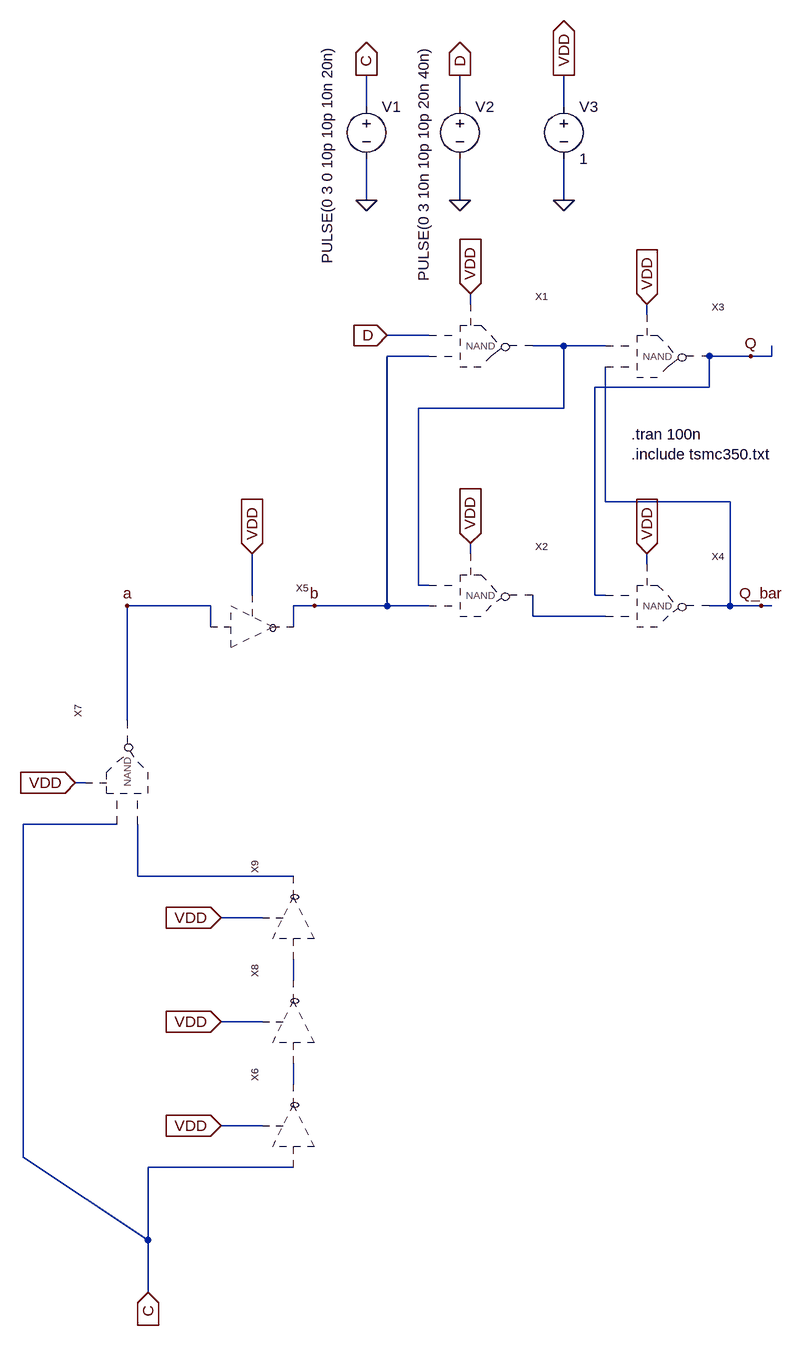
[diagram p0: schematic lab9t1.asc]
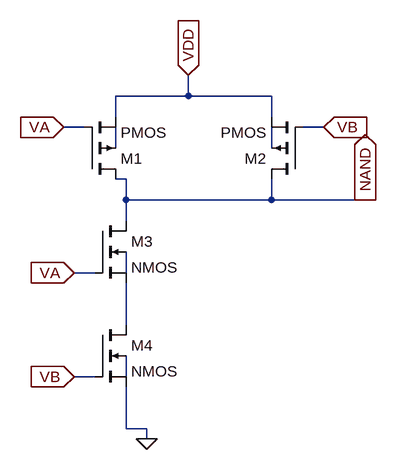
[diagram p1: sub-circuit nand.asc]
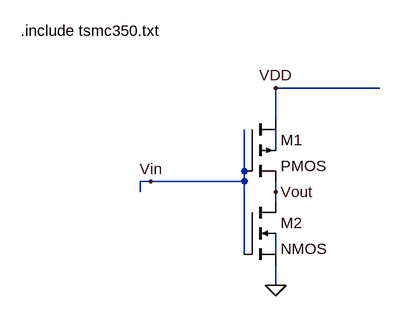
[diagram p2: sub-circuit symb.asc]
lab9t1.asc, the LTspice schematic file:
Version 4
SHEET 1 1080 1788
WIRE 416 -96 416 -144
WIRE 560 -96 560 -144
WIRE 720 -96 720 -144
WIRE 416 48 416 -16
WIRE 560 48 560 -16
WIRE 720 48 720 -16
WIRE 576 208 576 192
WIRE 848 224 848 208
WIRE 512 256 448 256
WIRE 720 272 672 272
WIRE 784 272 720 272
WIRE 512 288 448 288
WIRE 1008 288 944 288
WIRE 1040 288 1040 272
WIRE 1040 288 1008 288
WIRE 944 336 944 288
WIRE 944 336 768 336
WIRE 720 368 720 272
WIRE 720 368 496 368
WIRE 784 512 784 304
WIRE 976 512 784 512
WIRE 576 592 576 576
WIRE 848 608 848 592
WIRE 496 640 496 368
WIRE 512 640 496 640
WIRE 240 656 240 592
WIRE 768 656 768 336
WIRE 784 656 768 656
WIRE 176 672 48 672
WIRE 336 672 304 672
WIRE 448 672 448 288
WIRE 448 672 336 672
WIRE 512 672 448 672
WIRE 976 672 976 512
WIRE 976 672 944 672
WIRE 1024 672 976 672
WIRE 1040 672 1024 672
WIRE 672 688 672 656
WIRE 784 688 672 688
WIRE 176 704 176 672
WIRE 304 704 304 672
WIRE 48 848 48 672
WIRE -16 944 -32 944
WIRE 32 1008 -112 1008
WIRE 64 1088 64 1008
WIRE 304 1088 64 1088
WIRE 256 1152 192 1152
WIRE 304 1248 304 1216
WIRE 256 1312 192 1312
WIRE 304 1408 304 1376
WIRE 256 1472 192 1472
WIRE -112 1520 -112 1008
WIRE 304 1536 80 1536
WIRE 80 1648 -112 1520
WIRE 80 1648 80 1536
WIRE 80 1728 80 1648
FLAG 576 192 VDD
IOPIN 576 192 In
FLAG 848 208 VDD
IOPIN 848 208 In
FLAG 576 576 VDD
IOPIN 576 576 In
FLAG 848 592 VDD
IOPIN 848 592 In
FLAG 1008 288 Q
FLAG 1024 672 Q_bar
FLAG 448 256 D
IOPIN 448 256 In
FLAG 416 48 0
FLAG 560 48 0
FLAG 720 48 0
FLAG 416 -144 C
IOPIN 416 -144 Out
FLAG 560 -144 D
IOPIN 560 -144 Out
FLAG 720 -144 VDD
IOPIN 720 -144 Out
FLAG 192 1472 VDD
IOPIN 192 1472 In
FLAG -32 944 VDD
IOPIN -32 944 In
FLAG 240 592 VDD
IOPIN 240 592 In
FLAG 80 1728 C
IOPIN 80 1728 In
FLAG 336 672 b
FLAG 48 672 a
FLAG 192 1312 VDD
IOPIN 192 1312 In
FLAG 192 1152 VDD
IOPIN 192 1152 In
SYMBOL NAND 608 272 R0
SYMATTR InstName X1
SYMBOL NAND 608 656 R0
SYMATTR InstName X2
SYMBOL NAND 880 288 R0
SYMATTR InstName X3
SYMBOL NAND 880 672 R0
SYMATTR InstName X4
SYMBOL Voltage 416 -112 R0
WINDOW 3 -60 -79 VRight 2
SYMATTR Value PULSE(0 3 0 10p 10p 10n 20n)
SYMATTR InstName V1
SYMBOL Voltage 560 -112 R0
WINDOW 3 -56 -79 VRight 2
SYMATTR Value PULSE(0 3 10n 10p 10p 20n 40n)
SYMATTR InstName V2
SYMBOL Voltage 720 -112 R0
SYMATTR InstName V3
SYMATTR Value 1
SYMBOL NAND 48 912 R270
SYMATTR InstName X7
SYMBOL symb 240 704 R0
SYMATTR InstName X5
SYMBOL symb 304 1472 R270
SYMATTR InstName X6
SYMBOL symb 304 1312 R270
SYMATTR InstName X8
SYMBOL symb 304 1152 R270
SYMATTR InstName X9
TEXT 824 408 Left 2 !.tran 100n\n.include tsmc350.txt

nand.asc, the sub-circuit schematic file:
Version 4
SHEET 1 880 680
WIRE 416 112 416 80
WIRE 416 112 304 112
WIRE 544 112 416 112
WIRE 304 144 304 112
WIRE 544 144 544 112
WIRE 256 160 224 160
WIRE 624 160 592 160
WIRE 304 192 304 160
WIRE 544 192 544 160
WIRE 320 240 304 240
WIRE 320 272 320 240
WIRE 544 272 544 240
WIRE 544 272 320 272
WIRE 688 272 544 272
WIRE 704 272 688 272
WIRE 320 304 320 272
WIRE 272 384 240 384
WIRE 320 384 320 352
WIRE 320 464 320 400
WIRE 272 544 240 544
WIRE 320 544 320 512
WIRE 320 624 320 560
WIRE 352 624 320 624
WIRE 352 640 352 624
FLAG 352 640 0
FLAG 416 80 VDD
IOPIN 416 80 In
FLAG 688 272 NAND
IOPIN 688 272 Out
FLAG 624 160 VB
IOPIN 624 160 In
FLAG 224 160 VA
IOPIN 224 160 In
FLAG 240 384 VA
IOPIN 240 384 In
FLAG 240 544 VB
IOPIN 240 544 In
SYMBOL pmos4 256 240 M180
SYMATTR InstName M1
SYMATTR Value2 l=350n w=40u
SYMBOL pmos4 592 240 R180
SYMATTR InstName M2
SYMATTR Value2 l=350n w=40u
SYMBOL nmos4 272 304 R0
SYMATTR InstName M3
SYMATTR Value2 l=350n w=4u
SYMBOL nmos4 272 464 R0
SYMATTR InstName M4
SYMATTR Value2 l=350n w=4u

symb.asc, the sub-circuit schematic file:
Version 4
SHEET 1 880 680
WIRE 560 176 400 176
WIRE 400 224 400 176
WIRE 400 272 400 240
WIRE 352 304 352 240
WIRE 208 320 192 320
WIRE 352 320 352 304
WIRE 352 320 208 320
WIRE 192 336 192 320
WIRE 400 336 400 320
WIRE 400 352 400 336
WIRE 352 432 352 320
WIRE 400 432 400 400
WIRE 400 480 400 448
FLAG 400 480 0
FLAG 208 320 Vin
FLAG 400 176 VDD
FLAG 400 336 Vout
SYMBOL pmos4 352 224 R0
SYMATTR InstName M1
SYMATTR Value2 l=350n w=2u
SYMBOL nmos4 352 352 R0
SYMATTR InstName M2
SYMATTR Value2 l=350n w=1u
TEXT 8 88 Left 2 !.include tsmc350.txt

The netlist it stands for:
* lab9t1.asc
XX1 D b VDD N001 nand
XX2 N001 b VDD N002 nand
XX3 N001 Q_bar VDD Q nand
XX4 Q N002 VDD Q_bar nand
V1 C 0 PULSE(0 3 0 10p 10p 10n 20n)
V2 D 0 PULSE(0 3 10n 10p 10p 20n 40n)
V3 VDD 0 1
XX7 C N003 VDD a nand
XX5 a VDD b symb
XX6 C VDD N005 symb
XX8 N005 VDD N004 symb
XX9 N004 VDD N003 symb

* block symbol definitions
.subckt nand VA VB VDD NAND
M1 NAND VA VDD N001 PMOS l=350n w=40u
M2 NAND VB VDD N002 PMOS l=350n w=40u
M3 NAND VA N004 N003 NMOS l=350n w=4u
M4 N004 VB 0 N005 NMOS l=350n w=4u
.ends nand

.subckt symb Vin VDD Vout
M1 VDD Vin Vout N001 PMOS l=350n w=2u
M2 Vout Vin 0 N002 NMOS l=350n w=1u
.include tsmc350.txt
.ends symb

.model NMOS NMOS
.model PMOS PMOS
.lib standard.mos
.tran 100n
.include tsmc350.txt
.backanno
.end